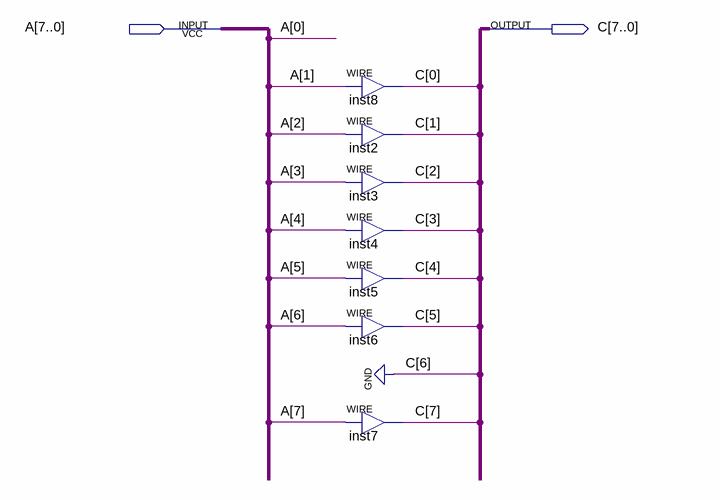
[diagram p0: schematic sheet]
// Quartus schematic SHRA_8R.bdf as structural Verilog: 7 symbols, 2 pins
module SHRA_8R (
  input  [7:0] A,
  output [7:0] C
);

  assign C[0] = A[1];  // WIRE inst8
  assign C[1] = A[2];  // WIRE inst2
  assign C[2] = A[3];  // WIRE inst3
  assign C[3] = A[4];  // WIRE inst4
  assign C[4] = A[5];  // WIRE inst5
  assign C[5] = A[6];  // WIRE inst6
  assign C[7] = A[7];  // WIRE inst7

  assign C[6] = 1'b0;
endmodule
